# Altium schematic sheet 01_Power.SchDoc: Temperature Logger
size A4; CompanyName: UnboxNbeyond; DocumentNumber: 1; SheetNumber: 1; SheetTotal: 2
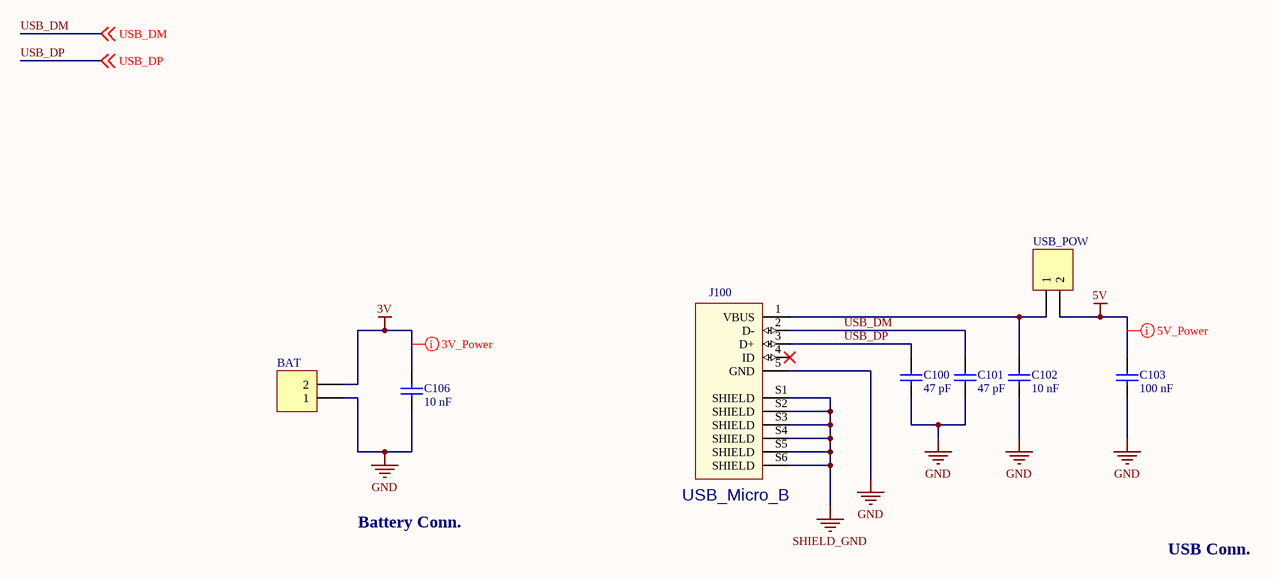
[diagram p0: 01_Power.SchDoc]

## Parts
BAT  (no value)  [HDR1X2]
C100  47 pF  [C0805]
C101  47 pF  [C0805]
C102  10 nF  [C0805]
C103  100 nF  [C0805]
C106  10 nF  [C0805]
J100  USB_Micro_B  [MicroUSB]
USB_POW  (no value)  [HDR1X2]

## Nets
3V: BAT.2 C106.2
5V: C103.2 USB_POW.2
GND: BAT.1 C100.1 C101.1 C102.1 C103.1 C106.1 J100.5(GND)
SHIELD_GND: J100.S1(SHIELD) J100.S2(SHIELD) J100.S3(SHIELD) J100.S4(SHIELD) J100.S5(SHIELD) J100.S6(SHIELD)
USB_DM: C101.2 J100.2(D-) ; off-sheet USB_DM
USB_DP: C100.2 J100.3(D+) ; off-sheet USB_DP
NetC102_2: C102.2 J100.1(VBUS) USB_POW.1

Not connected (* = marked no-connect by the designer): J100 4(ID)*

## Layout directives
rule Width Constraint [Pref Width = 15mil    Min Width = 10mil    Max Width = 20mil]: 3V
rule Width Constraint [Pref Width = 15mil    Min Width = 15mil    Max Width = 20mil]: 5V

## Notes on the sheet
- Battery Conn.
- USB Conn.
- Title
- Size:
- Date:
- A4
- Number:
- Time:
- Revision:
- Sheet
- of
- File:

## Library data of the parts
BAT USB_POW = Header 2: Header, 2-Pin; LatestRevisionDate: 17-Jul-2002; LatestRevisionNote: Re-released for DXP Platform.; Publisher: Altium Limited
C100 C101 = Cap-47pF: CAP CER 47PF 1KV C0G/NP0 0805; Manufacturer: KEMET; Manufacturer Part Number: C0805C470JDGACTU; Digikey_link: https://www.digikey.com.au/product-detail/en/kemet/C0805C470JDGACTU/399-7157-1-ND/3439404; Package: C0805; Price: 0.62 AUD; Value: 47 pF
C102 C106 = Cap-10nF: CAP CER 10000PF 10V X7R 0805; Manufacturer: Wurth Electronics Inc.; Manufacturer Part Number: 885012207011; Digikey_link: https://www.digikey.com.au/product-detail/en/wurth-electronics-inc/885012207011/732-8021-1-ND/5454648; Package: C0805; Price: 0.15 AUD; Value: 10 nF
C103 = Cap-100nF: CAP CER 0.1UF 50V X7R 0805; Manufacturer: KEMET; Manufacturer Part Number: C0805X104K5RACTU; Digikey_link: https://www.digikey.com.au/product-detail/en/kemet/C0805X104K5RACTU/399-5330-1-ND/1842309; Package: C0805; Price: 0.46 AUD; Value: 100 nF
J100 = USB_Micro_B: USB - micro B USB 2.0 Receptacle Connector 5 Position Surface Mount, Right Angle; Through Hole; Manufacturer Part Number: 2040002-1; Manufacturer: TE Connectivity; Value: USB Micro B; Package: USB-Micro-B; Price: 3.03 USD; Product_Type: Connector; Digikey_link: https://www.digikey.com.au/product-detail/en/te-connectivity-amp-connectors/2040002-1/A108263CT-ND/4021990